# Altium schematic sheet Audio_Input_Mic_Preamp.SchDoc: Audio Research: Microphone Preamp
size A4; DrawnBy: Connor Dack; Engineer: Connor Dack; DocumentNumber: 14; Revision: 1.0; SheetNumber: 14; SheetTotal: 20
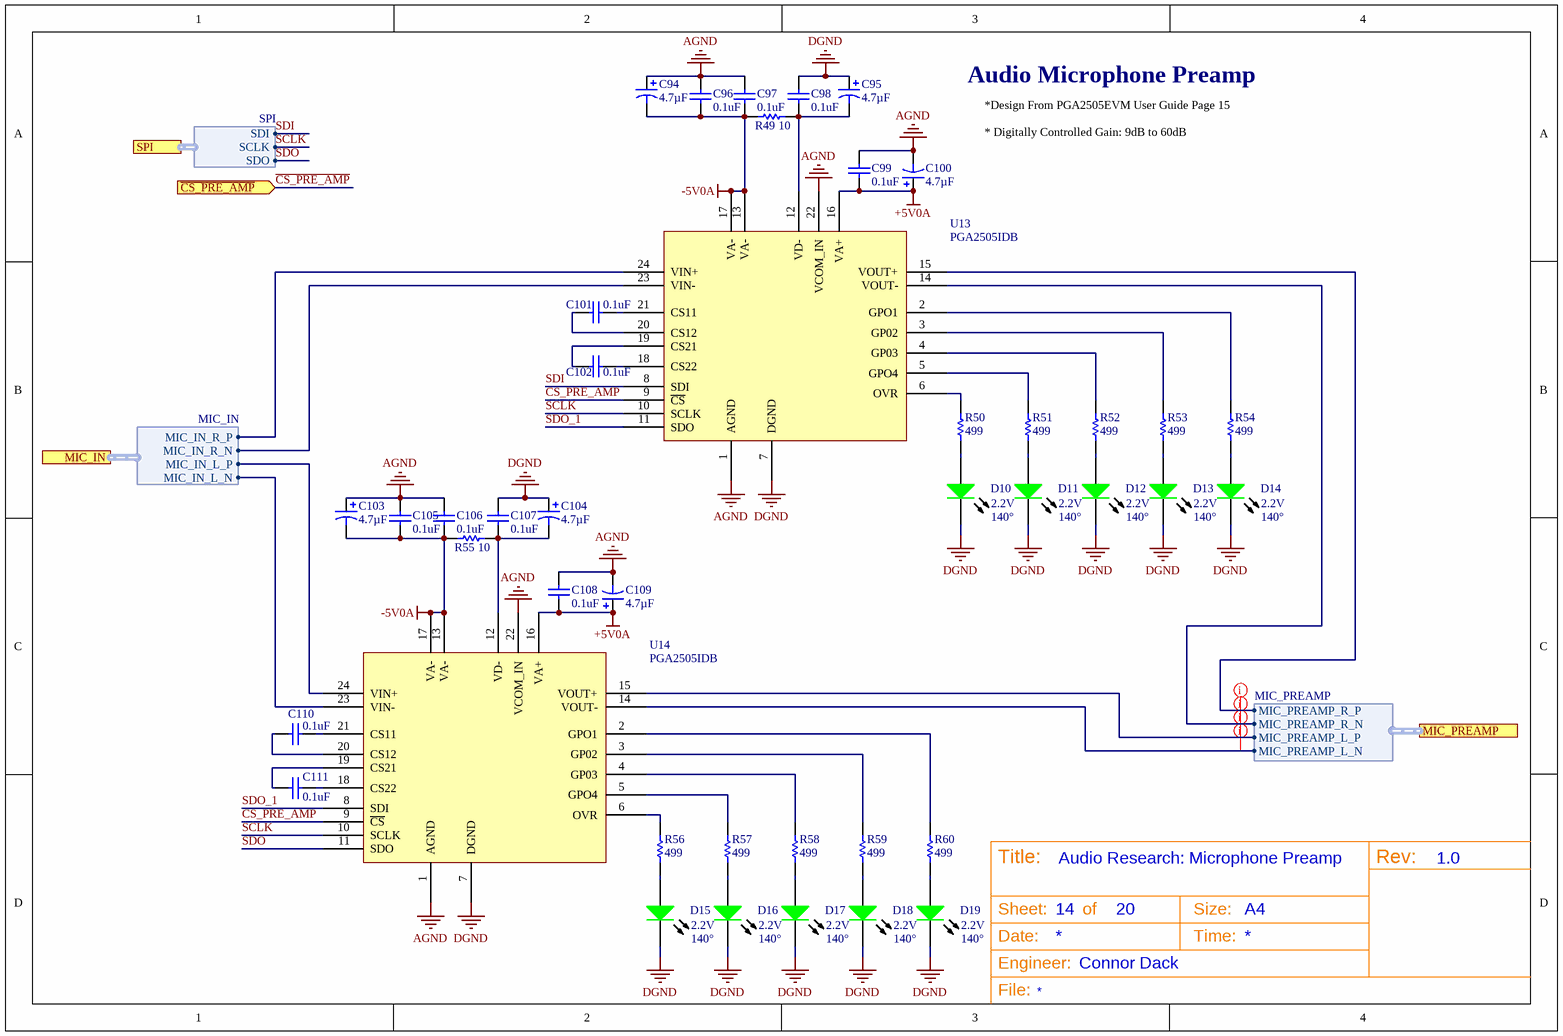
[diagram p0: Audio_Input_Mic_Preamp.SchDoc]

## Parts
C94  Capacitance: 4.7µF  [2917-Tantalum-Cap]  (hidden comment: T495D475K050ATE275)
C95  Capacitance: 4.7µF  [2917-Tantalum-Cap]  (hidden comment: T495D475K050ATE275)
C96  Capacitance: 0.1uF  [3-0603_L]  (hidden comment: CL10F104ZO8NNNC)
C97  Capacitance: 0.1uF  [3-0603_L]  (hidden comment: CL10F104ZO8NNNC)
C98  Capacitance: 0.1uF  [3-0603_L]  (hidden comment: CL10F104ZO8NNNC)
C99  Capacitance: 0.1uF  [3-0603_L]  (hidden comment: CL10F104ZO8NNNC)
C100  Capacitance: 4.7µF  [2917-Tantalum-Cap]  (hidden comment: T495D475K050ATE275)
C101  Capacitance: 0.1uF  [3-0603_L]  (hidden comment: CL10F104ZO8NNNC)
C102  Capacitance: 0.1uF  [3-0603_L]  (hidden comment: CL10F104ZO8NNNC)
C103  Capacitance: 4.7µF  [2917-Tantalum-Cap]  (hidden comment: T495D475K050ATE275)
C104  Capacitance: 4.7µF  [2917-Tantalum-Cap]  (hidden comment: T495D475K050ATE275)
C105  Capacitance: 0.1uF  [3-0603_L]  (hidden comment: CL10F104ZO8NNNC)
C106  Capacitance: 0.1uF  [3-0603_L]  (hidden comment: CL10F104ZO8NNNC)
C107  Capacitance: 0.1uF  [3-0603_L]  (hidden comment: CL10F104ZO8NNNC)
C108  Capacitance: 0.1uF  [3-0603_L]  (hidden comment: CL10F104ZO8NNNC)
C109  Capacitance: 4.7µF  [2917-Tantalum-Cap]  (hidden comment: T495D475K050ATE275)
C110  Capacitance: 0.1uF  [3-0603_L]  (hidden comment: CL10F104ZO8NNNC)
C111  Capacitance: 0.1uF  [3-0603_L]  (hidden comment: CL10F104ZO8NNNC)
D10  Voltage - Forward (Vf) Typ: 2.2V  Viewing Angle: 140°  [DIOCP3216X11L]  (hidden comment: LED_GREEN 2)
D11  Voltage - Forward (Vf) Typ: 2.2V  Viewing Angle: 140°  [DIOCP3216X11L]  (hidden comment: LED_GREEN 2)
D12  Voltage - Forward (Vf) Typ: 2.2V  Viewing Angle: 140°  [DIOCP3216X11L]  (hidden comment: LED_GREEN 2)
D13  Voltage - Forward (Vf) Typ: 2.2V  Viewing Angle: 140°  [DIOCP3216X11L]  (hidden comment: LED_GREEN 2)
D14  Voltage - Forward (Vf) Typ: 2.2V  Viewing Angle: 140°  [DIOCP3216X11L]  (hidden comment: LED_GREEN 2)
D15  Voltage - Forward (Vf) Typ: 2.2V  Viewing Angle: 140°  [DIOCP3216X11L]  (hidden comment: LED_GREEN 2)
D16  Voltage - Forward (Vf) Typ: 2.2V  Viewing Angle: 140°  [DIOCP3216X11L]  (hidden comment: LED_GREEN 2)
D17  Voltage - Forward (Vf) Typ: 2.2V  Viewing Angle: 140°  [DIOCP3216X11L]  (hidden comment: LED_GREEN 2)
D18  Voltage - Forward (Vf) Typ: 2.2V  Viewing Angle: 140°  [DIOCP3216X11L]  (hidden comment: LED_GREEN 2)
D19  Voltage - Forward (Vf) Typ: 2.2V  Viewing Angle: 140°  [DIOCP3216X11L]  (hidden comment: LED_GREEN 2)
R49  Resistance (Ohms): 10  [2-0402_R_L]  (hidden comment: ERJ-2RKF10R0X)
R50  Resistance (Ohms): 499  [3-0603_R_L]  (hidden comment: ERJ-3EKF4990V)
R51  Resistance (Ohms): 499  [3-0603_R_L]  (hidden comment: ERJ-3EKF4990V)
R52  Resistance (Ohms): 499  [3-0603_R_L]  (hidden comment: ERJ-3EKF4990V)
R53  Resistance (Ohms): 499  [3-0603_R_L]  (hidden comment: ERJ-3EKF4990V)
R54  Resistance (Ohms): 499  [3-0603_R_L]  (hidden comment: ERJ-3EKF4990V)
R55  Resistance (Ohms): 10  [2-0402_R_L]  (hidden comment: ERJ-2RKF10R0X)
R56  Resistance (Ohms): 499  [3-0603_R_L]  (hidden comment: ERJ-3EKF4990V)
R57  Resistance (Ohms): 499  [3-0603_R_L]  (hidden comment: ERJ-3EKF4990V)
R58  Resistance (Ohms): 499  [3-0603_R_L]  (hidden comment: ERJ-3EKF4990V)
R59  Resistance (Ohms): 499  [3-0603_R_L]  (hidden comment: ERJ-3EKF4990V)
R60  Resistance (Ohms): 499  [3-0603_R_L]  (hidden comment: ERJ-3EKF4990V)
U13  Microphone Preamp  [SOP65P780X200-24N]  (value not drawn)
U14  Microphone Preamp  [SOP65P780X200-24N]  (value not drawn)

## Ports
MIC_IN (harness MIC_IN), MIC_PREAMP (harness MIC_PREAMP), SPI (harness SPI), ~{CS_PRE_AMP} (in)

## Harnesses
MIC_IN: MIC_IN_R_P, MIC_IN_R_N, MIC_IN_L_N, MIC_IN_L_P
MIC_PREAMP: MIC_PREAMP_R_P, MIC_PREAMP_R_N, MIC_PREAMP_L_N, MIC_PREAMP_L_P
SPI: SDI, SCLK, SDO

## Nets
+5V0A: C99.2 C100.1(P) C108.2 C109.1(P) U13.16(VA+) U14.16(VA+)
-5V0A: C94.2(N) C96.2 C97.2 C103.2(N) C105.2 C106.2 R49.1 R55.1 U13.13(VA-) U13.17(VA-) U14.13(VA-) U14.17(VA-)
AGND: C94.1(P) C96.1 C97.1 C99.1 C100.2(N) C103.1(P) C105.1 C106.1 C108.1 C109.2(N) U13.1(AGND) U13.22(VCOM_IN) U14.1(AGND) U14.22(VCOM_IN)
DGND: C95.1(P) C98.1 C104.1(P) C107.1 D10.2(K) D11.2(K) D12.2(K) D13.2(K) D14.2(K) D15.2(K) D16.2(K) D17.2(K) D18.2(K) D19.2(K) U13.7(DGND) U14.7(DGND)
~{CS_PRE_AMP}: U13.9(~{CS}) U14.9(~{CS}) ; port ~{CS_PRE_AMP}
SCLK: U13.10(SCLK) U14.10(SCLK) ; port SPI.SCLK
SDI: U13.8(SDI) ; port SPI.SDI
SDO: U14.11(SDO) ; port SPI.SDO
SDO_1: U13.11(SDO) U14.8(SDI)
NetC95_2: C95.2(N) C98.2 R49.2 U13.12(VD-)
NetC101_1: C101.1 U13.21(CS11)
NetC101_2: C101.2 U13.20(CS12)
NetC102_1: C102.1 U13.18(CS22)
NetC102_2: C102.2 U13.19(CS21)
NetC104_2: C104.2(N) C107.2 R55.2 U14.12(VD-)
NetC110_1: C110.1 U14.21(CS11)
NetC110_2: C110.2 U14.20(CS12)
NetC111_1: C111.1 U14.18(CS22)
NetC111_2: C111.2 U14.19(CS21)
NetD10_1: D10.1(A) R50.1
NetD11_1: D11.1(A) R51.1
NetD12_1: D12.1(A) R52.1
NetD13_1: D13.1(A) R53.1
NetD14_1: D14.1(A) R54.1
NetD15_1: D15.1(A) R56.1
NetD16_1: D16.1(A) R57.1
NetD17_1: D17.1(A) R58.1
NetD18_1: D18.1(A) R59.1
NetD19_1: D19.1(A) R60.1
NetR50_2: R50.2 U13.6(OVR)
NetR51_2: R51.2 U13.5(GPO4)
NetR52_2: R52.2 U13.4(GP03)
NetR53_2: R53.2 U13.3(GP02)
NetR54_2: R54.2 U13.2(GPO1)
NetR56_2: R56.2 U14.6(OVR)
NetR57_2: R57.2 U14.5(GPO4)
NetR58_2: R58.2 U14.4(GP03)
NetR59_2: R59.2 U14.3(GP02)
NetR60_2: R60.2 U14.2(GPO1)
NetU13_14: U13.14(VOUT-) ; port MIC_PREAMP.MIC_PREAMP_R_N
NetU13_15: U13.15(VOUT+) ; port MIC_PREAMP.MIC_PREAMP_R_P
NetU13_23: U13.23(VIN-) ; port MIC_IN.MIC_IN_R_N
NetU13_24: U13.24(VIN+) ; port MIC_IN.MIC_IN_R_P
NetU14_14: U14.14(VOUT-) ; port MIC_PREAMP.MIC_PREAMP_L_N
NetU14_15: U14.15(VOUT+) ; port MIC_PREAMP.MIC_PREAMP_L_P
NetU14_23: U14.23(VIN-) ; port MIC_IN.MIC_IN_L_N
NetU14_24: U14.24(VIN+) ; port MIC_IN.MIC_IN_L_P

## Layout directives
net class Mic_Preamp_In: NetU13_14, NetU13_15, NetU14_14, NetU14_15

## Notes on the sheet
- Audio Microphone Preamp
- *Design From PGA2505EVM User Guide Page 15
  * Digitally Controlled Gain: 9dB to 60dB
- Title:
- Sheet:
- of
- Size:
- A4
- Rev:
- Date:
- Engineer:
- Time:
- File:

## Library data of the parts
C94 C95 C100 C103 C104 C109 = T495D475K050ATE275: CAP TANT 4.7UF 50V 10% 2917; Manufacturer: KEMET; Manufacturer Size Code: D; Type: Molded; ESR (Equivalent Series Resistance): 275 mOhm; Lifetime @ Temp.: 2000 Hrs @ 85°C; Supplier 1: Digi-Key; Manufacturer Part Number: T495D475K050ATE275; RoHS: RoHS Compliant; Category: Capacitors; Stock 1: 9255; Pricing 1: 1=2.05, 10=1.656, 25=1.5052, 50=1.445, 100=1.2644, 250=1.0838 (USD); Packaging: Cut Tape (CT); Part Status: Active; Tolerance: ±10%; Voltage - Rated: 50V; Operating Temperature: -55°C ~ 125°C; Mounting Type: Surface Mount; Package / Case: 2917 (7343 Metric); Size / Dimension: 0.287" L x 0.169" W (7.30mm x 4.30mm); Height - Seated (Max): 0.122" (3.10mm); Lead Spacing: -; Features: General Purpose; Failure Rate: -; ComponentLink1URL: http://www.kemet.com/docfinder?Partnumber=T495D475K050ATE275; ComponentLink1Description: http://www.kemet.com/docfinder?Partnumber=T495D475K050ATE275; Supplier Part Number 1: 399-4786-1-ND
C96-C99 C101 C102 C105-C108 C110 C111 = CL10F104ZO8NNNC: CAP CER 0.1UF 16V Y5V 0603; Manufacturer: Samsung; Tolerance: 80%; Supplier 1: Digi-Key; Stock 1: 40000; Pricing 1: 1=0.1, 10=0.038, 100=0.0169, 500=0.01208, 1000=0.00949 (USD); Mount: Surface Mount; Case/Package: 0603; Case Code (Metric): 1608; Case Code (Imperial): 0603; Min Operating Temperature: -30°C; Max Operating Temperature: 85°C; Package Quantity: 1; Packaging: Tape and Reel; Voltage Rating: 16V; Dielectric: Y5V; Length: 1.6mm; Height: 0.8mm; Width: 0.031inch; Thickness: 0.035inch; Depth: 0.8mm; Radiation Hardening: No; ComponentLink1URL: https://datasheet.ciiva.com/25805/cl10f104zo8nnnc-25805810.pdf; ComponentLink1Description: https://datasheet.ciiva.com/25805/cl10f104zo8nnnc-25805810.pdf; ComponentLink2URL: https://datasheet.ciiva.com/16199/cl10f104zo8nnnc-16199254.pdf; ComponentLink2Description: https://datasheet.ciiva.com/16199/cl10f104zo8nnnc-16199254.pdf; Supplier Part Number 1: 1276-1258-6-ND; Manufacturer Part Number: CL10F104ZO8NNNC
D10-D19 = LED_GREEN 2: LED ALINGAP ULT GRN CLR 1206 SMD; Manufacturer: Lumex Opto/Components Inc; Manufacturer Part Number: SML-LX1206SUGC-TR; Color: Green; Millicandela Rating: 45mcd; Current - Test: 20mA; Wavelength - Peak: 574nm; Lens Type: Clear; Lens Style/Size: Rectangle with Flat Top, 2mm x 1.6mm; Supplier 1: Digi-Key; RoHS: RoHS Compliant; Category: Optoelectronics; Stock 1: 11785; Pricing 1: 1=0.64, 10=0.49, 100=0.3534, 250=0.31352, 500=0.2679, 1000=0.2109 (USD); Wavelength - Dominant: -; Package / Case: 1206 (3216 Metric); Size / Dimension: 3.20mm L x 1.60mm W; Height: 1.10mm; Mounting Type: Surface Mount; Packaging: Cut Tape (CT); Luminous Flux @ Current - Test: -; ComponentLink1URL: http://www.lumex.com/specs/SML-LX1206SUGC-TR.pdf; ComponentLink1Description: http://www.lumex.com/specs/SML-LX1206SUGC-TR.pdf; Supplier Part Number 1: 67-1698-1-ND
R49 R55 = ERJ-2RKF10R0X: RES 10 OHM 1/10W 1% 0402 SMD; Manufacturer: Panasonic Electronic Components; Power (Watts): 0.1W, 1/10W; Temperature Coefficient: ±100ppm/°C; Supplier 1: Digi-Key; Manufacturer Part Number: ERJ-2RKF10R0X; RoHS: RoHS Compliant; Category: Resistors; Stock 1: 1086258; Pricing 1: 1=0.1, 50=0.0196, 100=0.0149, 250=0.01104, 500=0.00816, 1000=0.00544, 5000=0.00383 (USD); Packaging: Cut Tape (CT); Tolerance: ±1%; Composition: Thick Film; Features: -; Package / Case: 0402 (1005 Metric); Supplier Device Package: 0402; Size / Dimension: 0.039" L x 0.020" W (1.00mm x 0.50mm); Height: 0.016" (0.40mm); Number of Terminations: 2; ComponentLink1URL: http://industrial.panasonic.com/www-cgi/jvcr13pz.cgi?E+PZ+3+AOA0002+ERJ2RKF10R0X+7+WW; ComponentLink1Description: http://industrial.panasonic.com/www-cgi/jvcr13pz.cgi?E+PZ+3+AOA0002+ERJ2RKF10R0X+7+WW; Supplier Part Number 1: P10.0LCT-ND
R50-R54 R56-R60 = ERJ-3EKF4990V: RES 499 OHM 1/10W 1% 0603 SMD; Manufacturer: Panasonic - ECG; Power (Watts): 0.1W, 1/10W; Temperature Coefficient: ±100ppm/°C; Supplier 1: Digi-Key; Manufacturer Part Number: ERJ-3EKF4990V; RoHS: RoHS Compliant; Category: Resistors; Stock 1: 748630; Pricing 1: 1=0.1, 50=0.0138, 100=0.0105, 250=0.0078, 500=0.00576, 1000=0.00384 (USD); Composition: Thick Film; Features: -; Tolerance: ±1%; Package / Case: 0603 (1608 Metric); Size / Dimension: 0.063" L x 0.031" W (1.60mm x 0.80mm); Height: 0.022" (0.55mm); Number of Terminations: 2; Packaging: Cut Tape (CT); ComponentLink1URL: http://industrial.panasonic.com/www-cgi/jvcr13pz.cgi?E+PZ+3+AOA0002+ERJ3EKF4990V+7+WW; ComponentLink1Description: http://industrial.panasonic.com/www-cgi/jvcr13pz.cgi?E+PZ+3+AOA0002+ERJ3EKF4990V+7+WW; Supplier Part Number 1: P499HCT-ND
U13 U14 = PGA2505IDB: IC DGTL CTRLR MICOPHN AMP 24SSOP; Manufacturer: Texas Instruments; Number of Channels: 1; Max Supply Voltage: 5.25V; Min Supply Voltage: 4.75V; Operating Supply Current: 30mA; Input Offset Voltage (Vos): 1mV; Gain: 60dB; Interface: SPI; Dual Supply Voltage: 5V; Input Voltage Noise Density: 3nV/sqrt Hz; Min Dual Supply Voltage: -4.75V; Load Impedance: 600R; Supplier 1: Digi-Key; Stock 1: 358; Pricing 1: 1=10.98, 10=10.088, 100=8.52, 500=7.5792, 1000=6.9519 (USD); Case/Package: SSOP; Number of Pins: 24; Weight: 0.007764oz; Min Operating Temperature: -40°C; Max Operating Temperature: 85°C; Packaging: Rail/Tube; Package Quantity: 60; Max Input Voltage: 5.25V; Quiescent Current: 30mA; Max Dual Supply Voltage: 5.25V; Operating Supply Voltage: 5V; Length: 8.2mm; Height: 1.95mm; Width: 5.3mm; Radiation Hardening: No; REACH SVHC: No SVHC; Lead Free: Lead Free; ComponentLink1URL: https://datasheet.ciiva.com/1789/pga2505-1789587.pdf; ComponentLink1Description: https://datasheet.ciiva.com/1789/pga2505-1789587.pdf; ComponentLink2URL: https://datasheet.ciiva.com/2968/pga2505-2968036.pdf; ComponentLink2Description: https://datasheet.ciiva.com/2968/pga2505-2968036.pdf; ComponentLink3URL: https://datasheet.ciiva.com/15131/getdatasheetpartid-220694-15131828.pdf; ComponentLink3Description: https://datasheet.ciiva.com/15131/getdatasheetpartid-220694-15131828.pdf; ComponentLink4URL: https://datasheet.ciiva.com/26118/sbos396b-26118602.pdf; ComponentLink4Description: https://datasheet.ciiva.com/26118/sbos396b-26118602.pdf; ComponentLink5URL: https://datasheet.ciiva.com/1481/1772560-1481451.pdf; ComponentLink5Description: https://datasheet.ciiva.com/1481/1772560-1481451.pdf; ComponentLink6URL: https://datasheet.ciiva.com/26842/pga2505idb-26842003.pdf; ComponentLink6Description: https://datasheet.ciiva.com/26842/pga2505idb-26842003.pdf; Supplier Part Number 1: 296-24572-5-ND; Manufacturer Part Number: PGA2505IDB